# Altium schematic sheet Main.SchDoc
size A4
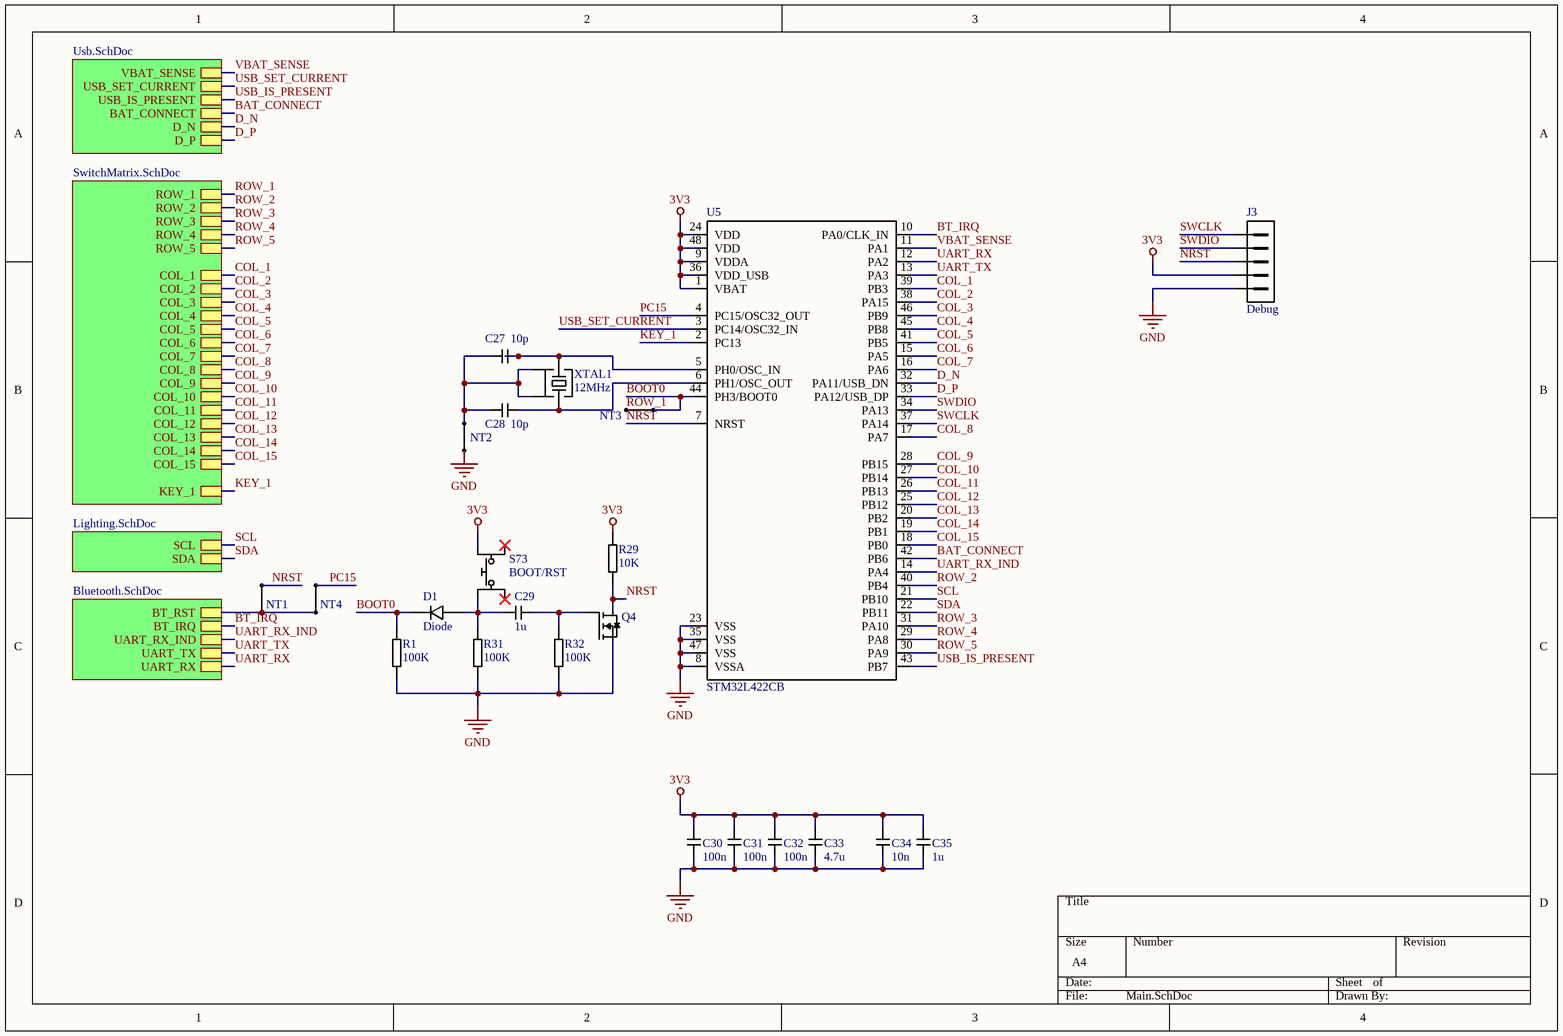
[diagram p0: Main.SchDoc]

## Parts
C27  10p  [Capacitor_0603]
C28  10p  [Capacitor_0603]
C29  1u  [Capacitor_0603]
C30  100n  [Capacitor_0603]
C31  100n  [Capacitor_0603]
C32  100n  [Capacitor_0603]
C33  4.7u  [Capacitor_0603]
C34  10n  [Capacitor_0603]
C35  1u  [Capacitor_0603]
D1  Diode  [SOD_323]
J3  Debug  [Header_male_1x5_1.27mm]
NT1  Net tie  [Resistor_0603]  (value not drawn)  (net tie, no BOM)
NT2  Net tie  [Net_tie]  (value not drawn)  (net tie, no BOM)
NT3  Net tie  [Net_tie]  (value not drawn)  (net tie, no BOM)
NT4  Net tie  [Resistor_0603]  (value not drawn)  (net tie, no BOM)
Q4  NMOS  [SOT_233]  (value not drawn)
R1  100K  [Resistor_0603]
R29  10K  [Resistor_0603]
R31  100K  [Resistor_0603]
R32  100K  [Resistor_0603]
S73  BOOT/RST  [Tactile_switch_3.5x3mm_4P]
U5  STM32L422CB  [QFP_48_7mm]
XTAL1  12MHz  [Crystal_3225]

## Sub-sheets
Bluetooth = Bluetooth.SchDoc: BT_RST, BT_IRQ, UART_RX_IND, UART_TX, UART_RX
Lighting = Lighting.SchDoc: SCL, SDA
Switch matrix = SwitchMatrix.SchDoc: KEY_1, COL_15, COL_8, COL_6, ROW_3, COL_9, COL_13, COL_11, ROW_5, ROW_4, COL_12, COL_4, COL_5, COL_7, COL_3, ROW_1, COL_1, COL_14, ROW_2, COL_10, COL_2
USB = Usb.SchDoc: USB_IS_PRESENT, USB_SET_CURRENT, VBAT_SENSE, D_P, D_N, BAT_CONNECT

## Nets
3V3: C30.2 C31.2 C32.2 C33.2 C34.2 C35.2 J3.4 R29.2 S73.3 U5.1(VBAT) U5.9(VDDA) U5.24(VDD) U5.36(VDD_USB) U5.48(VDD)
GND: C30.1 C31.1 C32.1 C33.1 C34.1 C35.1 J3.5 NT2.1 Q4.2 R1.1 R31.1 R32.1 U5.8(VSSA) U5.23(VSS) U5.35(VSS) U5.47(VSS)
BAT_CONNECT: U5.42(PB6) ; sheet USB/BAT_CONNECT
BOOT0: D1.K NT3.2 R1.2 U5.44(PH3/BOOT0)
BT_IRQ: U5.10(PA0/CLK_IN) ; sheet Bluetooth/BT_IRQ
COL_1: U5.39(PB3) ; sheet Switch matrix/COL_1
COL_2: U5.38(PA15) ; sheet Switch matrix/COL_2
COL_3: U5.46(PB9) ; sheet Switch matrix/COL_3
COL_4: U5.45(PB8) ; sheet Switch matrix/COL_4
COL_5: U5.41(PB5) ; sheet Switch matrix/COL_5
COL_6: U5.15(PA5) ; sheet Switch matrix/COL_6
COL_7: U5.16(PA6) ; sheet Switch matrix/COL_7
COL_8: U5.17(PA7) ; sheet Switch matrix/COL_8
COL_9: U5.28(PB15) ; sheet Switch matrix/COL_9
COL_10: U5.27(PB14) ; sheet Switch matrix/COL_10
COL_11: U5.26(PB13) ; sheet Switch matrix/COL_11
COL_12: U5.25(PB12) ; sheet Switch matrix/COL_12
COL_13: U5.20(PB2) ; sheet Switch matrix/COL_13
COL_14: U5.19(PB1) ; sheet Switch matrix/COL_14
COL_15: U5.18(PB0) ; sheet Switch matrix/COL_15
D_N: U5.32(PA11/USB_DN) ; sheet USB/D_N
D_P: U5.33(PA12/USB_DP) ; sheet USB/D_P
KEY_1: U5.2(PC13) ; sheet Switch matrix/KEY_1
NRST: J3.3 NT1.2 Q4.3 R29.1 U5.7(NRST)
PC15: NT4.2 U5.4(PC15/OSC32_OUT)
ROW_1: NT3.1 ; sheet Switch matrix/ROW_1
ROW_2: U5.40(PB4) ; sheet Switch matrix/ROW_2
ROW_3: U5.31(PA10) ; sheet Switch matrix/ROW_3
ROW_4: U5.29(PA8) ; sheet Switch matrix/ROW_4
ROW_5: U5.30(PA9) ; sheet Switch matrix/ROW_5
SCL: U5.21(PB10) ; sheet Lighting/SCL
SDA: U5.22(PB11) ; sheet Lighting/SDA
SWCLK: J3.2 U5.37(PA14)
SWDIO: J3.1 U5.34(PA13)
UART_RX: U5.12(PA2) ; sheet Bluetooth/UART_RX
UART_RX_IND: U5.14(PA4) ; sheet Bluetooth/UART_RX_IND
UART_TX: U5.13(PA3) ; sheet Bluetooth/UART_TX
USB_IS_PRESENT: U5.43(PB7) ; sheet USB/USB_IS_PRESENT
USB_SET_CURRENT: U5.3(PC14/OSC32_IN) ; sheet USB/USB_SET_CURRENT
VBAT_SENSE: U5.11(PA1) ; sheet USB/VBAT_SENSE
NetC27_1: C27.1 C28.1 NT2.2 XTAL1.2 XTAL1.4
NetC27_2: C27.2 U5.5(PH0/OSC_IN) XTAL1.1
NetC28_2: C28.2 U5.6(PH1/OSC_OUT) XTAL1.3
NetC29_1: C29.1 D1.A R31.2 S73.1
NetC29_2: C29.2 Q4.1 R32.2
NetNT1_1: NT1.1 NT4.1 ; sheet Bluetooth/BT_RST

Not connected (* = marked no-connect by the designer): S73 2* 4*

## Library data of the parts
C27-C35 = Capacitor
J3 = Connector_5P
R1 R29 R31 R32 = Resistor
S73 = Pushbutton_4P
XTAL1 = Crystal_4P